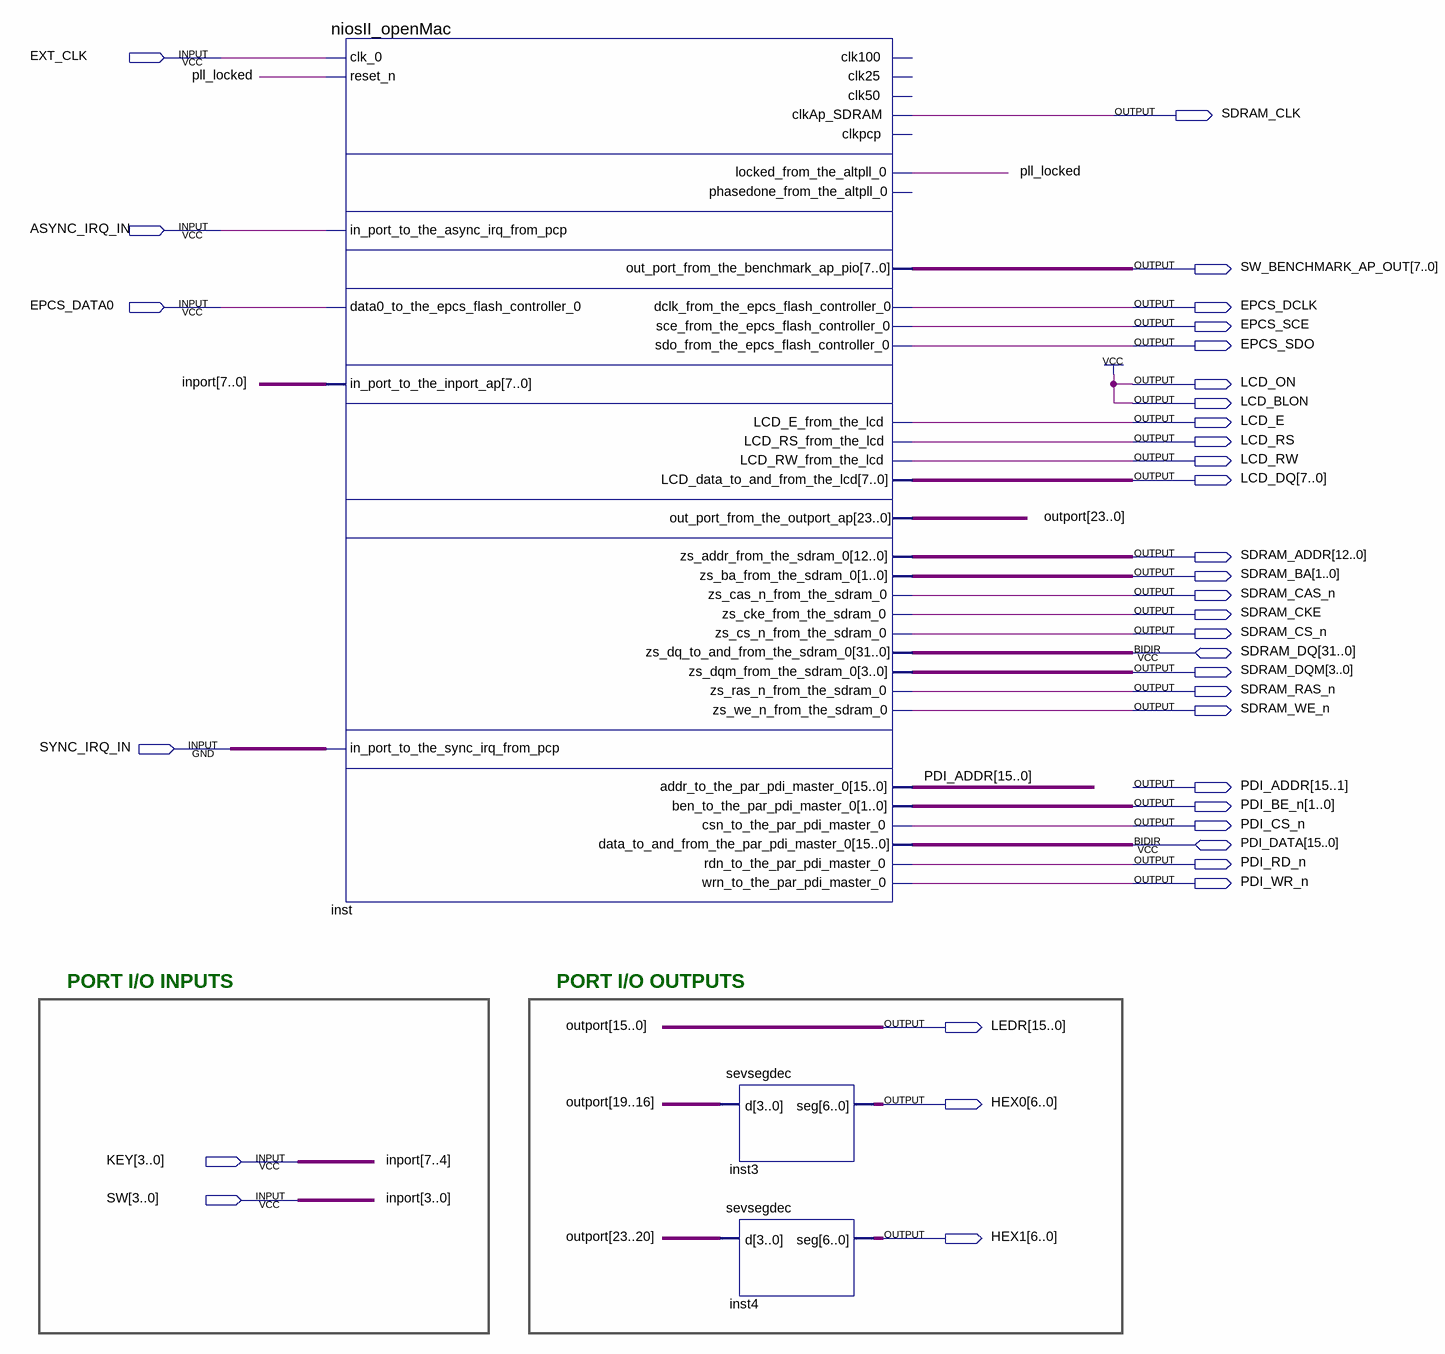
[diagram p0: schematic sheet]
// Quartus schematic nios_pll.bdf as structural Verilog: 3 symbols, 35 pins
module nios_pll (
  input  EXT_CLK,
  input  ASYNC_IRQ_IN,
  input  EPCS_DATA0,
  input  SYNC_IRQ_IN,
  input  [3:0] KEY,
  input  [3:0] SW,
  inout  [31:0] SDRAM_DQ,
  inout  [15:0] PDI_DATA,
  output SDRAM_CLK,
  output [7:0] SW_BENCHMARK_AP_OUT,
  output EPCS_DCLK,
  output EPCS_SCE,
  output EPCS_SDO,
  output LCD_ON,
  output LCD_BLON,
  output LCD_E,
  output LCD_RS,
  output LCD_RW,
  output [7:0] LCD_DQ,
  output [12:0] SDRAM_ADDR,
  output [1:0] SDRAM_BA,
  output SDRAM_CAS_n,
  output SDRAM_CKE,
  output SDRAM_CS_n,
  output [3:0] SDRAM_DQM,
  output SDRAM_RAS_n,
  output SDRAM_WE_n,
  output [15:0] PDI_ADDR,
  output [1:0] PDI_BE_n,
  output PDI_CS_n,
  output PDI_RD_n,
  output PDI_WR_n,
  output [15:0] LEDR,
  output [6:0] HEX0,
  output [6:0] HEX1
);

  wire pll_locked;
  wire [23:16] outport;

  niosII_openMac inst (
    .clk_0(EXT_CLK), .reset_n(pll_locked), .in_port_to_the_async_irq_from_pcp(ASYNC_IRQ_IN),
    .data0_to_the_epcs_flash_controller_0(EPCS_DATA0), .in_port_to_the_inport_ap({KEY, SW}),
    .in_port_to_the_sync_irq_from_pcp(SYNC_IRQ_IN), .clkAp_SDRAM(SDRAM_CLK),
    .locked_from_the_altpll_0(pll_locked), .out_port_from_the_benchmark_ap_pio(SW_BENCHMARK_AP_OUT),
    .dclk_from_the_epcs_flash_controller_0(EPCS_DCLK), .sce_from_the_epcs_flash_controller_0(EPCS_SCE),
    .sdo_from_the_epcs_flash_controller_0(EPCS_SDO), .LCD_E_from_the_lcd(LCD_E),
    .LCD_RS_from_the_lcd(LCD_RS), .LCD_RW_from_the_lcd(LCD_RW),
    .out_port_from_the_outport_ap({outport, LEDR}), .zs_addr_from_the_sdram_0(SDRAM_ADDR),
    .zs_ba_from_the_sdram_0(SDRAM_BA), .zs_cas_n_from_the_sdram_0(SDRAM_CAS_n),
    .zs_cke_from_the_sdram_0(SDRAM_CKE), .zs_cs_n_from_the_sdram_0(SDRAM_CS_n),
    .zs_dqm_from_the_sdram_0(SDRAM_DQM), .zs_ras_n_from_the_sdram_0(SDRAM_RAS_n),
    .zs_we_n_from_the_sdram_0(SDRAM_WE_n), .addr_to_the_par_pdi_master_0(PDI_ADDR),
    .ben_to_the_par_pdi_master_0(PDI_BE_n), .csn_to_the_par_pdi_master_0(PDI_CS_n),
    .rdn_to_the_par_pdi_master_0(PDI_RD_n), .wrn_to_the_par_pdi_master_0(PDI_WR_n),
    .LCD_data_to_and_from_the_lcd(LCD_DQ), .zs_dq_to_and_from_the_sdram_0(SDRAM_DQ),
    .data_to_and_from_the_par_pdi_master_0(PDI_DATA));  // open: clk100, clk25, clk50, clkpcp, phasedone_from_the_altpll_0
  sevsegdec inst3 (.d(outport[19:16]), .seg(HEX0));
  sevsegdec inst4 (.d(outport[23:20]), .seg(HEX1));

  assign LCD_BLON = 1'b1;
  assign LCD_ON = 1'b1;

  // Other names for the same wires on the sheet: inport[7:0] = {KEY, SW}; outport[15:0] = LEDR

  // Notes on the sheet:
  //   PORT I/O INPUTS
  //   PORT I/O OUTPUTS
endmodule
